# Altium schematic sheet Smart_Lighting_System_P2.SchDoc
size A; SPICEModelCacheFQGIOPTN: <root> / <DocumentId>FQGIOPTN</DocumentId> / <CacheFrame Number="0"> / <Model Name="cap" Kind="MDL"> / <Text>*Default semiconductor capacitor / .MODEL CAP C()</Text> / </Model> / <Model Name="diode" Kind="MDL"> / <Text>*Default Diode / *Diode Pinout: A,K / .MODEL DIODE D()</Text> / </Model> / </CacheFrame> / </root>
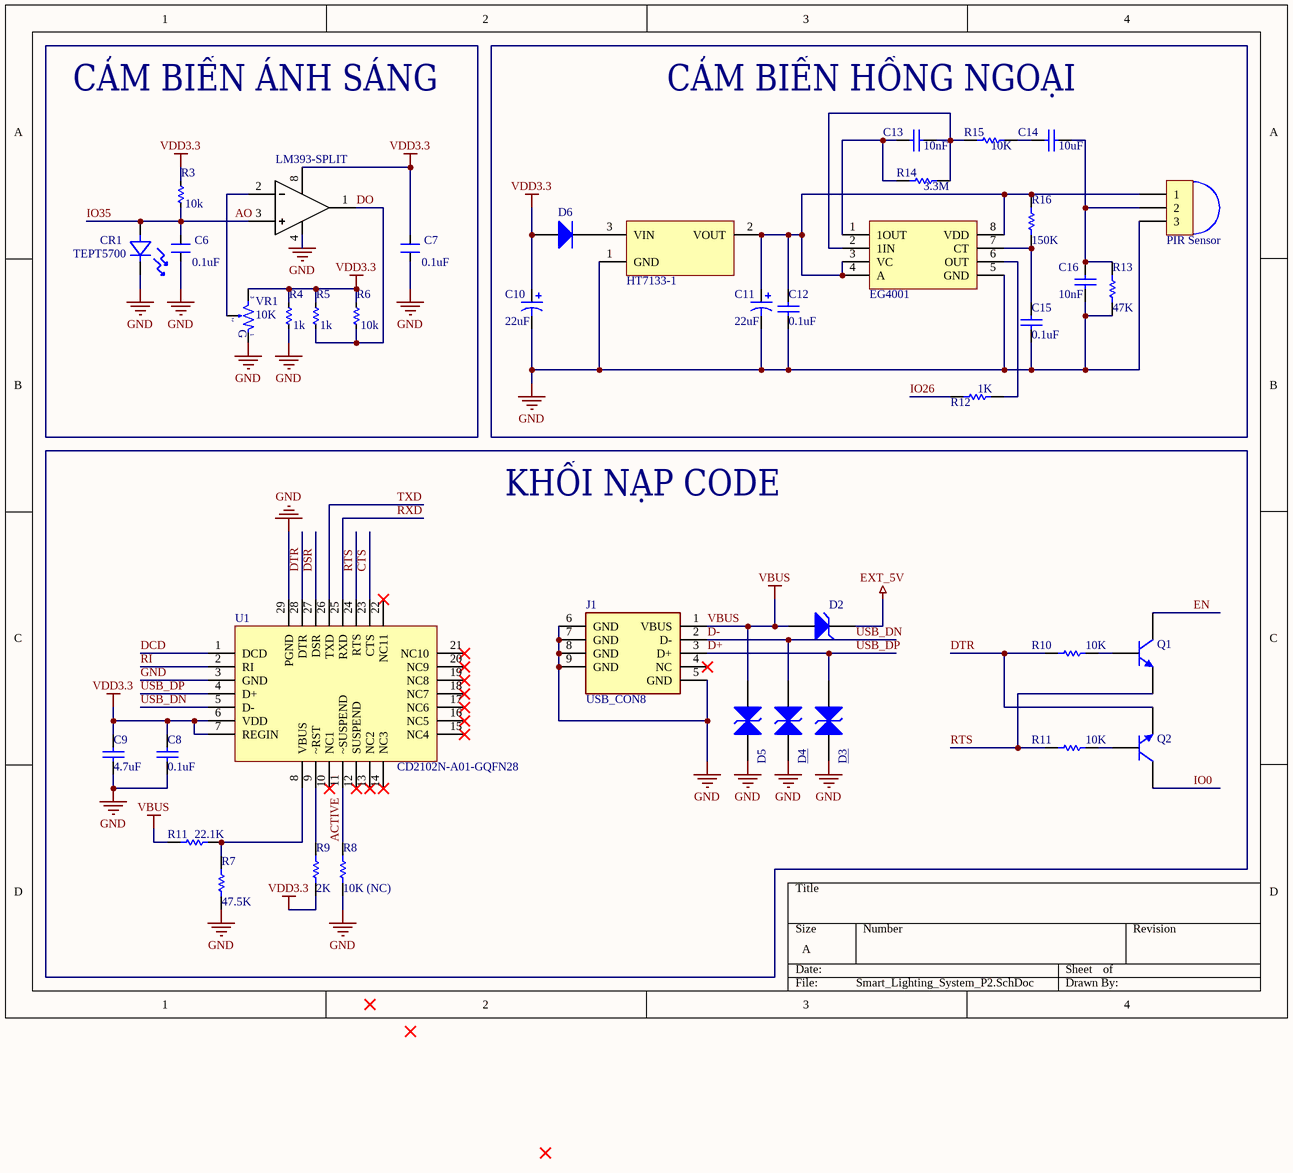
[diagram p0: Smart_Lighting_System_P2.SchDoc]

## Parts
(Parts that share a designator on the sheet are numbered #1, #2 ... from top to bottom, then left to right.)
3.3v_Regulator  HT7133-1
*#1  PIR Sensor
*#2  EG4001
C6  0.1uF  [CN-SMD-0805]
C7  0.1uF  [CN-SMD-0805]
C8  value 0.1uF  (hidden comment: Capacitor)
C9  value 4.7uF  (hidden comment: Capacitor)
C10  value 22uF  [RB7.6-15]
C11  value 22uF  [RB7.6-15]
C12  value 0.1uF  (hidden comment: Capacitor)
C13  value 10nF  (hidden comment: Capacitor)
C14  value 10uF  (hidden comment: Capacitor)
C15  value 0.1uF  (hidden comment: Capacitor)
C16  value 10nF  (hidden comment: Capacitor)
CR1  TEPT5700  [LED_TEPT5700]
D2  Zener Diode  (value not drawn)
D3  Suppressor Dual  (value not drawn)
D4  Suppressor Dual  (value not drawn)
D5  Suppressor Dual  (value not drawn)
D6  Diode  [SMC]  (value not drawn)
J1  USB_CON8
Q1  Bipolar  NPN 3 Pins  Transistor   Gummel-Poon Model  (value not drawn)
Q2  Bipolar  NPN 3 Pins  Transistor   Gummel-Poon Model  (value not drawn)
R3  10k  [RES-SMD-0805]
R4  1k  [RES-SMD-0805]
R5  1k  [RES-SMD-0805]
R6  10k  [RES-SMD-0805]
R7  value 47.5K  (hidden comment: Resistor)
R8  value 10K (NC)  (hidden comment: Resistor)
R9  value 2K  (hidden comment: Resistor)
R10  value 10K  (hidden comment: Resistor)
R11#1  value 10K  (hidden comment: Resistor)
R11#2  value 22.1K  (hidden comment: Resistor)
R12  value 1K  (hidden comment: Resistor)
R13  value 47K  (hidden comment: Resistor)
R14  value 3.3M  (hidden comment: Resistor)
R15  value 10K  (hidden comment: Resistor)
R16  value 150K  (hidden comment: Resistor)
U1  CD2102N-A01-GQFN28
U?  LM393-SPLIT  [DIP8]  (part A of 2)
VR1  10K  [VR-S3]

## Nets
EXT_5V: D2.2(K)
GND: 3.3v_Regulator.1(GND) *#1.72(3) *#2.5(GND) C6.1 C7.1 C8.1 C9.1 C10.2 C11.2 C12.1 C15.1 C16.1 CR1.1 D3.1 D4.1 D5.1 J1.5(GND) J1.6(GND) J1.7(GND) J1.8(GND) J1.9(GND) R4.2 R7.1 R8.1 R13.1 U1.3(GND) U1.29(PGND) U?.4(Vcc-) VR1.1
VBUS: D2.1(A) D5.2 J1.1(VBUS) R11#2.2
VDD3.3: C7.2 C8.2 C9.2 C10.1 D6.1(A) R3.1 R4.1 R5.1 R6.1 R9.1 U1.6(VDD) U1.7(REGIN) U?.8(Vcc+) VR1.3
ACTIVE: R8.2 U1.11(~SUSPEND)
AO: C6.2 CR1.2 R3.2 U?.3  [also labelled IO35]
CTS: U1.23(CTS)
D+: D3.2 J1.3(D+) U1.4(D+)  [also labelled USB_DP]
D-: D4.2 J1.2(D-) U1.5(D-)  [also labelled USB_DN]
DCD: U1.1(DCD)
DO: R5.2 R6.2 U?.1
DSR: U1.27(DSR)
DTR: Q2.3(E) R10.2 U1.28(DTR)
EN: Q1.1(C)
IO0: Q2.1(C)
IO26: R12.2
RI: U1.2(RI)
RTS: Q1.3(E) R11#1.2 U1.24(RTS)
RXD: U1.25(RXD)
TXD: U1.26(TXD)
Net3.3v_Regulator_2: 3.3v_Regulator.2(VOUT) *#1.70(1) *#2.3(VC) *#2.4(A) *#2.8(VDD) C11.1 C12.2 R16.2
Net3.3v_Regulator_3: 3.3v_Regulator.3(VIN) D6.2(K)
Net*#1_71: *#1.71(2) C14.1 C16.2 R13.2
Net*#2_1: *#2.1(1OUT) C13.2 R14.2
Net*#2_2: *#2.2(1IN) C13.1 R14.1 R15.2
Net*#2_6: *#2.6(OUT) R12.1
Net*#2_7: *#2.7(CT) C15.2 R16.1
NetC14_2: C14.2 R15.1
NetQ1_2: Q1.2(B) R10.1
NetQ2_2: Q2.2(B) R11#1.1
NetR7_2: R7.2 R11#2.1 U1.8(VBUS)
NetR9_2: R9.2 U1.9(~RST)
NetU?_2: U?.2 VR1.2

Not connected (* = marked no-connect by the designer): J1 4(NC)*; U1 10(NC1)* 12(SUSPEND)* 13(NC2)* 14(NC3)* 15(NC4)* 16(NC5)* 17(NC6)* 18(NC7)* 19(NC8)* 20(NC9)* 21(NC10)* 22(NC11)*

## Notes on the sheet
- CẢM BIẾN ÁNH SÁNG
- CẢM BIẾN HỒNG NGOẠI
- KHỐI NẠP CODE
- (in symbol VR-S) G

## Library data of the parts
3.3v_Regulator *#1 *#2 = Component_1
C6 C7 = CN: Value: 33pF
C8 C9 C12-C16 = Capacitor: SimulationGenericComponent: True
C10 C11 = Cap Pol1: Polarized Capacitor (Radial); Published: 8-Jun-2000; LatestRevisionDate: 17-Jul-2002; LatestRevisionNote: Re-released for DXP Platform.; PackageReference: RB7.6-15; Publisher: Altium Limited; PackageDescription: Polarized Capacitor (Radial); 2 Leads
CR1 = TEPT5700: AMBIENT LIGHT SENSOR PHOTOTRANSISTOR CHIP SILICON 570NM 2-PIN T-1 3/4 | Siliconix / Vishay TEPT5700; MF: Vishay Semiconductors; SnapEDA_Link: https://www.snapeda.com/parts/TEPT5700/Vishay/view-part/?ref=snap; Package: None; Value: *; MP: TEPT5700; Check_prices: https://www.snapeda.com/parts/TEPT5700/Vishay/view-part/?ref=eda
D2 = Zener Diode: AF: 1; BV_MAX: 1e99; CJO: 0; EG: 1.11; FC: 0.5; IBV: 0.001; IS: 1e-14; MJSW: 0.33; NTUN: 30; TNOM: 27; XTI: 3; SimulationGenericComponent: True; BV: 100; CJP: 0; CTA: 0; CTP: 0; FCS: 0.5; FV_MAX: 1e99; IKF: 0; IKR: 0; ISR: 1e-14; JSW: 0; JTUN: 0; JTUNSW: 0; KEG: 1; KF: 0; LEVEL: 1; N: 1; NBV: 1; NR: 1; NS: 1; PHP: 1; RS: 0; TCV: 0; TLEV: 0; TLEVC: 0; TM1: 0; TM2: 0; TPB: 0; TPHP: 0; TRS: 0; TRS2: 0; TT: 0; TTT1: 0; TTT2: 0; VJ: 1; XTITUN: 3
D3-D5 = Suppressor Dual: area: 1; temp: 27; dtemp: 0; EG: 1.11; FC: 0.5; IBV: 100p; IS: 10f; NTUN: 30; XTITUN: 3; MJSW: 0.33; BV_MAX: 1e99; SimulationGenericComponent: True; m: 1; pj: 1; AF: 1; BV: 0; CJO: 0; IBVL: 0; IKF: 0; IKR: 0; JSW: 0; JTUN: 0; JTUNSW: 0; KEG: 1; CJP: 0; FCS: 0.5; PHP: 1; ISR: 0; KF: 0; N: 1; NBV: 1; NBVL: 1; NR: 1; NS: 1; RS: 0; TBV1: 0; TBV2: 0; TIKF: 0; TRS1: 0; TRS2: 0; TT: 0; VJ: 1; XTI: 3; TNOM: 27; TM1: 0; TM2: 0; TTT1: 0; TTT2: 0; TLEV: 0; TLEVC: 0; CTA: 0; CTP: 0; TCV: 0; TVJ: 0; TPHP: 0; FV_MAX: 1e99
D6 = Diode: Default Diode; Published: 8-Jun-2000; LatestRevisionDate: 17-Jul-2002; LatestRevisionNote: Re-released for DXP Platform.; PackageVersion: Sep-1996; PackageReference: SMC; Publisher: Altium Limited; PackageDescription: DO-214-AB/SMC; 2 C-Bend Leads; Body 7.9 x 5.9 mm, inc. leads (LxW); Code_JEDEC: DO-214-AB
Q1 Q2 = BJT NPN_GP: SimulationGenericComponent: True; BF: 100; AF: 0; BR: 1; EG: 1.11; FC: 0.5; IS: 1e-16; MJC: 0.33; NC: 2; NE: 1.5; TNOM: 27; VBC_MAX: 1e99; VJC: 0.75; XTI: 3; CJC: 0; CJE: 0; CJS: 0; CTC: 0; CTE: 0; CTS: 0; IKF: 0; IKR: 0; IRB: 0; ISC: 0; ISE: 0; ISS: 0; ITF: 0; KF: 0; MJE: 0.33; MJS: 0; NF: 1; NKF: 0.5; NR: 1; NS: 1; PTF: 0; RB: 0; RBM: 0; RC: 0; RE: 0; SUBS: 1; TBF1: 0; TBF2: 0; TBR1: 0; TBR2: 0; TF: 0; TIKF1: 0; TIKF2: 0; TIKR1: 0; TIKR2: 0; TIRB1: 0; TIRB2: 0; TIS1: 0; TIS2: 0; TISC1: 0; TISC2: 0; TISE1: 0; TISE2: 0; TITF1: 0; TITF2: 0; TLEV: 0; TLEVC: 0; TMJC1: 0; TMJC2: 0; TMJE1: 0; TMJE2: 0; TMJS1: 0; TMJS2: 0; TNC1: 0; TNC2: 0; TNE1: 0; TNE2: 0; TNF1: 0; TNF2: 0; TNR1: 0; TNR2: 0; TNS1: 0; TNS2: 0; TR: 0; TRB1: 0; TRB2: 0; TRC1: 0; TRC2: 0; TRE1: 0; TRE2: 0; TRM1: 0; TRM2: 0; TTF1: 0; TTF2: 0; TTR1: 0; TTR2: 0; TVAF1: 0; TVAF2: 0; TVAR1: 0; TVAR2: 0; TVJC: 0; TVJE: 0; TVJS: 0; VAF: 0; VAR: 0; VBE_MAX: 1e99; VCE_MAX: 1e99; VJE: 0.75; VJS: 0.75; VTF: 0; XCJC: 1; XTB: 0; XTF: 0
R3-R6 = Res-SMD: Resistor; Manufacturer: Generic Components; Class: Passive; Published: 08/06/2000; Publisher: Altium Hobart Technology Centre
R7-R10 R11#1 R11#2 R12-R16 = Resistor: TC1: 0; SimulationGenericComponent: True; TC2: 0
U? = LM393-SPLIT: IC DUAL COMPARATOR; Supplier 1: Digi-Key; Supplier Part Number 1: LM393MXFSDKR-ND
VR1 = VR-S: Var Resistor; Value: Volume 50k